# Altium schematic sheet Diff AMP Inputs.SchDoc
size A4
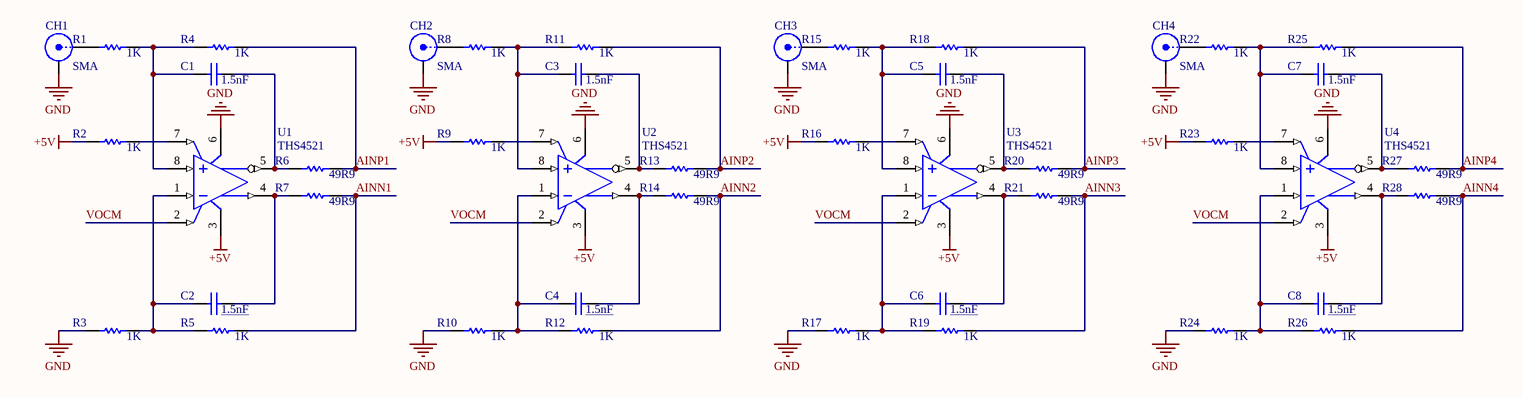
[diagram p0: Diff AMP Inputs.SchDoc]

## Parts
C1  1.5nF  [CAPC0603(1608)55_M]
C2  1.5nF  [CAPC0603(1608)55_M]
C3  1.5nF  [CAPC0603(1608)55_M]
C4  1.5nF  [CAPC0603(1608)55_M]
C5  1.5nF  [CAPC0603(1608)55_M]
C6  1.5nF  [CAPC0603(1608)55_M]
C7  1.5nF  [CAPC0603(1608)55_M]
C8  1.5nF  [CAPC0603(1608)55_M]
CH1  SMA  [SMA-V]
CH2  SMA  [SMA-V]
CH3  SMA  [SMA-V]
CH4  SMA  [SMA-V]
R1  1K  [RESC0603(1608)_M]
R2  1K  [RESC0603(1608)_M]
R3  1K  [RESC0603(1608)_M]
R4  1K  [RESC0603(1608)_M]
R5  1K  [RESC0603(1608)_M]
R6  49R9  [RESC0603(1608)_M]
R7  49R9  [RESC0603(1608)_M]
R8  1K  [RESC0603(1608)_M]
R9  1K  [RESC0603(1608)_M]
R10  1K  [RESC0603(1608)_M]
R11  1K  [RESC0603(1608)_M]
R12  1K  [RESC0603(1608)_M]
R13  49R9  [RESC0603(1608)_M]
R14  49R9  [RESC0603(1608)_M]
R15  1K  [RESC0603(1608)_M]
R16  1K  [RESC0603(1608)_M]
R17  1K  [RESC0603(1608)_M]
R18  1K  [RESC0603(1608)_M]
R19  1K  [RESC0603(1608)_M]
R20  49R9  [RESC0603(1608)_M]
R21  49R9  [RESC0603(1608)_M]
R22  1K  [RESC0603(1608)_M]
R23  1K  [RESC0603(1608)_M]
R24  1K  [RESC0603(1608)_M]
R25  1K  [RESC0603(1608)_M]
R26  1K  [RESC0603(1608)_M]
R27  49R9  [RESC0603(1608)_M]
R28  49R9  [RESC0603(1608)_M]
U1  THS4521  [SOIC8]
U2  THS4521  [SOIC8]
U3  THS4521  [SOIC8]
U4  THS4521  [SOIC8]

## Nets
+5V: R2.1 R9.1 R16.1 R23.1 U1.3(VS+) U2.3(VS+) U3.3(VS+) U4.3(VS+)
GND: CH1.2(Y) CH2.2(Y) CH3.2(Y) CH4.2(Y) R3.1 R10.1 R17.1 R24.1 U1.6(VS-) U2.6(VS-) U3.6(VS-) U4.6(VS-)
AINN1: R5.2 R7.2
AINN2: R12.2 R14.2
AINN3: R19.2 R21.2
AINN4: R26.2 R28.2
AINP1: R4.2 R6.2
AINP2: R11.2 R13.2
AINP3: R18.2 R20.2
AINP4: R25.2 R27.2
VOCM: U1.2(VOCM) U2.2(VOCM) U3.2(VOCM) U4.2(VOCM)
NetC1_1: C1.1 R1.2 R4.1 U1.8(VIN+)
NetC1_2: C1.2 R6.1 U1.5(VOUT-)
NetC2_1: C2.1 R3.2 R5.1 U1.1(VIN-)
NetC2_2: C2.2 R7.1 U1.4(VOUT+)
NetC3_1: C3.1 R8.2 R11.1 U2.8(VIN+)
NetC3_2: C3.2 R13.1 U2.5(VOUT-)
NetC4_1: C4.1 R10.2 R12.1 U2.1(VIN-)
NetC4_2: C4.2 R14.1 U2.4(VOUT+)
NetC5_1: C5.1 R15.2 R18.1 U3.8(VIN+)
NetC5_2: C5.2 R20.1 U3.5(VOUT-)
NetC6_1: C6.1 R17.2 R19.1 U3.1(VIN-)
NetC6_2: C6.2 R21.1 U3.4(VOUT+)
NetC7_1: C7.1 R22.2 R25.1 U4.8(VIN+)
NetC7_2: C7.2 R27.1 U4.5(VOUT-)
NetC8_1: C8.1 R24.2 R26.1 U4.1(VIN-)
NetC8_2: C8.2 R28.1 U4.4(VOUT+)
NetCH1_1: CH1.1(X) R1.1
NetCH2_1: CH2.1(X) R8.1
NetCH3_1: CH3.1(X) R15.1
NetCH4_1: CH4.1(X) R22.1
NetR2_2: R2.2 U1.7(~{PD})
NetR9_2: R9.2 U2.7(~{PD})
NetR16_2: R16.2 U3.7(~{PD})
NetR23_2: R23.2 U4.7(~{PD})

## Library data of the parts
C1-C8 = CAP
R1-R28 = RES
CH1-CH4 = SMA: LatestRevisionDate: 17-Jul-2002; LatestRevisionNote: Re-released for DXP Platform.; Publisher: Altium Limited